# EAGLE design tps92512 (EAGLE 7.1.0)
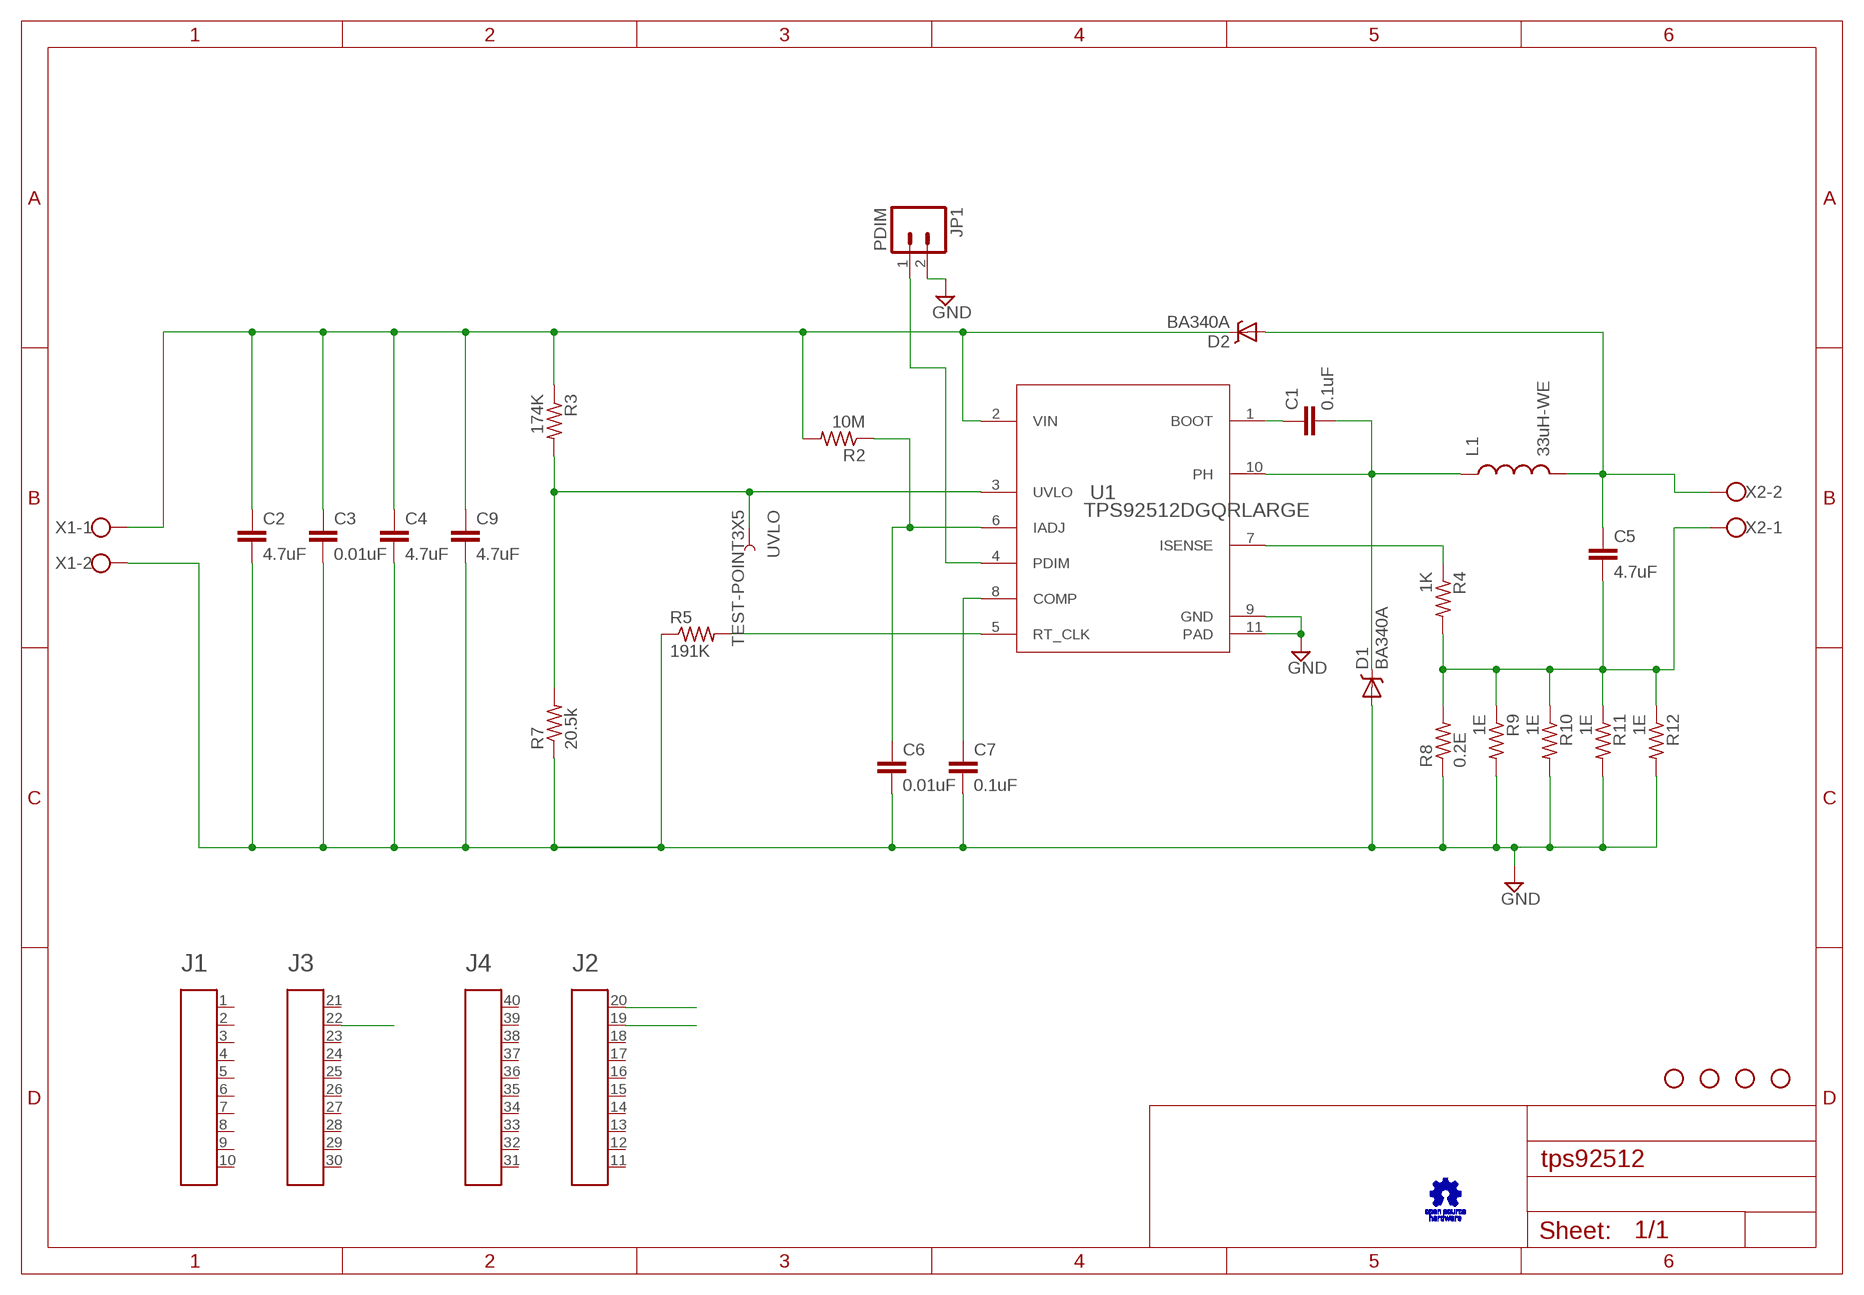
[diagram p0: schematic, sheet 1]

## Parts
A1  HEADER4X10-BOOSTERPACK  [4X10-BOOSTERPACK]
C1  0.1uF  CAP0805  [0805]
C2  4.7uF  10UF50V20%(1210)  [1210]
C3  0.01uF  CAP0805  [0805]
C4  4.7uF  10UF50V20%(1210)  [1210]
C5  4.7uF  10UF-6.3V-20%(1206)  [1206]
C6  0.01uF  CAP0805  [0805]
C7  0.1uF  CAP0805  [0805]
C9  4.7uF  10UF50V20%(1210)  [1210]
D1  BA340A  B340A  [SMA-DIODE]
D2  BA340A  B340A  [SMA-DIODE]
JP1  PDIM  M02LOCK  [1X02_LOCK]
L1  33uH-WE  INDUCTORDR1030  [DR1030]
R2  10M  R-US_R0805  [R0805]
R3  174K  R-US_R0805  [R0805]
R4  1K  R-US_R0805  [R0805]
R5  191K  R-US_R0805  [R0805]
R7  20.5k  R-US_R0805  [R0805]
R8  0.2E  R-US_R1210W  [R1210W]
R9  1E  R-US_R0805  [R0805]
R10  1E  R-US_R0805  [R0805]
R11  1E  R-US_R0805  [R0805]
R12  1E  R-US_R0805  [R0805]
STANDOFF1  STAND-OFF  [STAND-OFF]
STANDOFF2  STAND-OFF  [STAND-OFF]
STANDOFF3  STAND-OFF  [STAND-OFF]
STANDOFF4  STAND-OFF  [STAND-OFF]
U1  TPS92512DGQRLARGE  [DGQ0010D_M]
UVLO  TEST-POINT3X5  [PAD.03X.05]
X1  W237-102  [W237-102]
X2  W237-102  [W237-102]

## Nets
GND: A1.20 A1.22 C2.2 C3.2 C4.2 C6.2 C7.2 C9.2 D1.A JP1.2 R5.1 R7.1 R8.1 R9.2 R10.2 R11.2 R12.2 U1.9(GND) U1.11(PAD) X1.2
LEDMINUS: C5.2 R4.2 R8.2 R9.1 R10.1 R11.1 R12.1 X2.1
LEDPLUS: C5.1 D2.A L1.2 X2.2
N$1: C7.1 U1.8(COMP)
N$4: C6.1 R2.1 U1.6(IADJ)
N$5: C1.1 U1.1(BOOT)
N$8: R5.2 U1.5(RT_CLK)
N$9: R3.2 R7.2 U1.3(UVLO) UVLO.P$1
N$12: R4.1 U1.7(ISENSE)
PDIM: A1.19 JP1.1 U1.4(PDIM)
PINTEN: C1.2 D1.C L1.1 U1.10(PH)
VIN: C2.1 C3.1 C4.1 C9.1 D2.C R2.2 R3.1 U1.2(VIN) X1.1
Unconnected: A1.1 A1.2 A1.3 A1.4 A1.5 A1.6 A1.7 A1.8 A1.9 A1.10 A1.11 A1.12 A1.13 A1.14 A1.15 A1.16 A1.17 A1.18 A1.21 A1.23 A1.24 A1.25 A1.26 A1.27 A1.28 A1.29 A1.30 A1.31 A1.32 A1.33 A1.34 A1.35 A1.36 A1.37 A1.38 A1.39 A1.40

## Library data of the parts
A1 = EAGLE_BoosterPack_Library:HEADER4X10-BOOSTERPACK
C1 C3 C6 C7 = SparkFun-Capacitors:CAP: Capacitor Standard 0603 ceramic capacitor, and 0.1" leaded capacitor.
C2 C4 C9 = SparkFun-Capacitors:10UF50V20%(1210): CAP-09824; PROD_ID: CAP-09824; VALUE: 10uF
C5 = SparkFun-Capacitors:10UF-6.3V-20%(1206): Ceramic CAP-10057; PROD_ID: CAP-10057; VALUE: 10uF
D1 D2 = SparkFun-DiscreteSemi:B340A: Schottky Diode 3A-40V; PROD_ID: DIO-09886
JP1 = SparkFun-Connectors:M02: Standard 2-pin 0.1" header. Use with - straight break away headers ( PRT-00116) - right angle break away headers (PRT-00553) - swiss pins (PRT-00743) - machine pins (PRT-00117) - female headers (PRT-00115) Molex polarized connector foot print use with: PRT-08233 with associated crimp pins and housings. 2.54_SCREWTERM for use with PRT-10571. 3.5mm Screw Terminal footprints for PRT-08084 5mm Screw Terminal footprints for use with PRT-08433
L1 = SparkFun-Passives:INDUCTOR: Inductors Basic Inductor/Choke - 0603 and 1206. Footprints are not proven and vary greatly between part numbers. SRN6045- 33uH, 20% 1.4A SDR0403-560KL - 56uH, 10%, 500mA RMS/740mA peak
R2-R5 R7-R12 = adafruit:R-US_: RESISTOR, American symbol
STANDOFF1-STANDOFF4 = SparkFun-Electromechanical:STAND-OFF: #4 Stand Off This is the mechanical footprint for a #4 phillips button head screw. Use the keepout ring to avoid running the screw head into surrounding components. SKU : PRT-00447
U1 = TPS92512:TPS92512DGQR
UVLO = SparkFun-Passives:TEST-POINT: Bare copper test points for troubleshooting or ICT
X1 X2 = con-wago-500:W237-102: WAGO SCREW CLAMP; MPN: 237-102; OC_FARNELL: unknown; OC_NEWARK: 70K9898

## Board
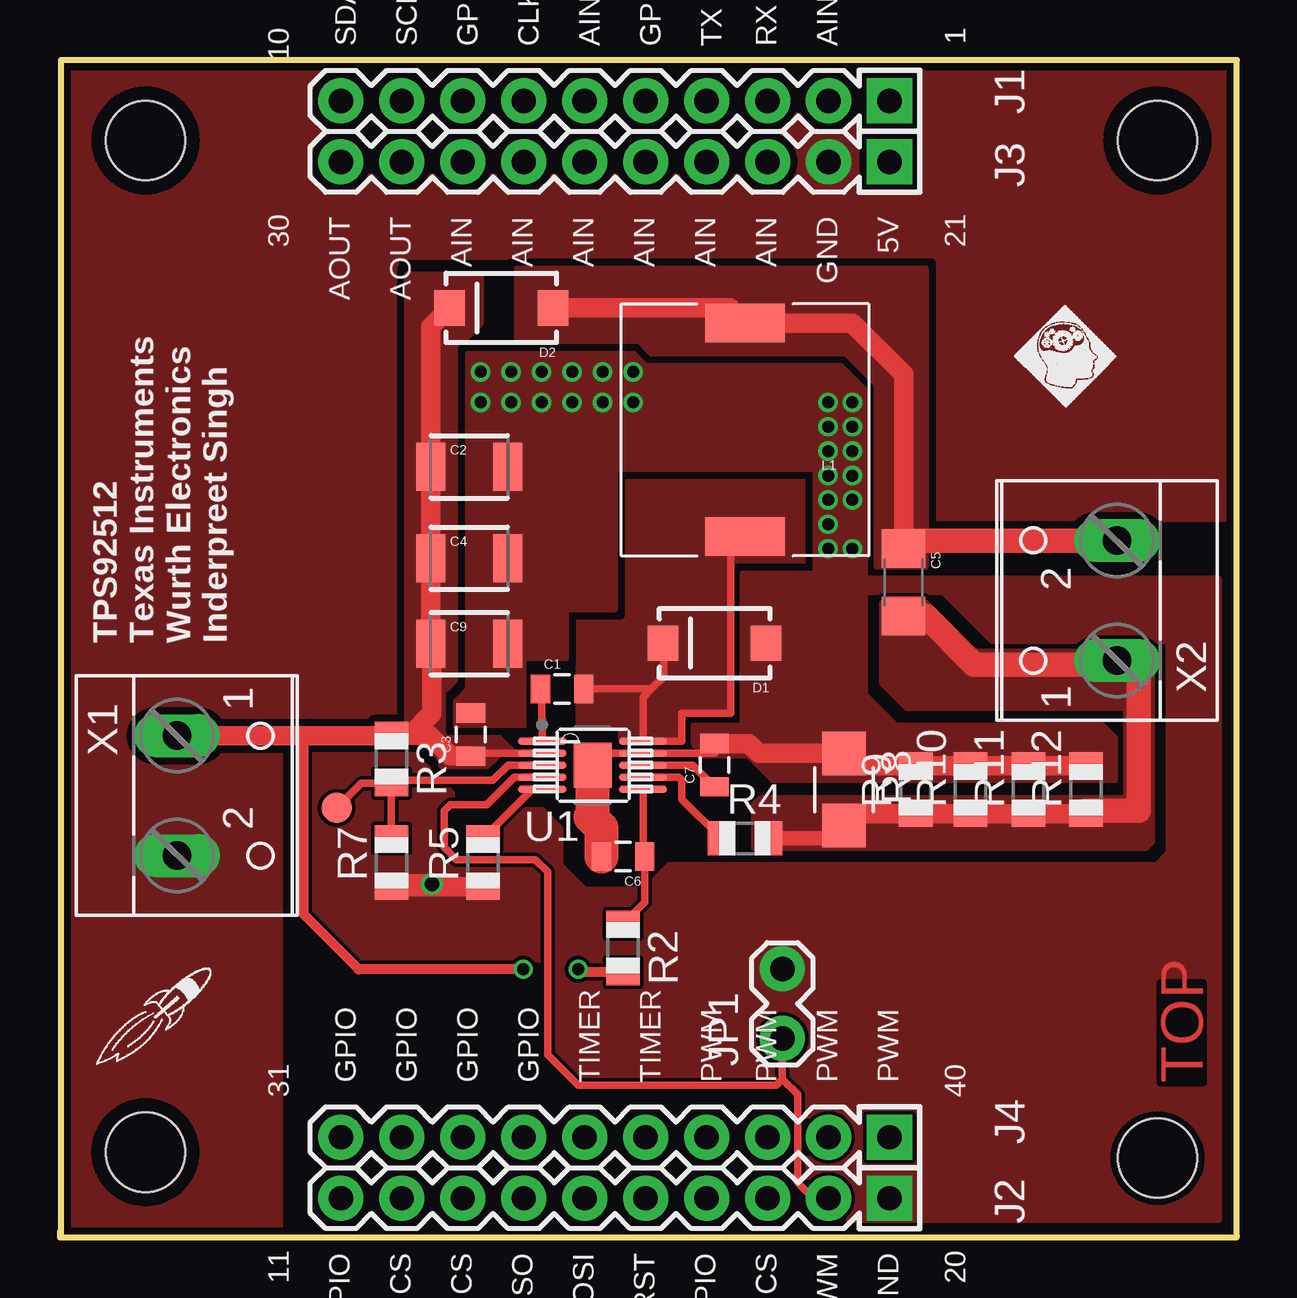
[diagram p1: board, top side]
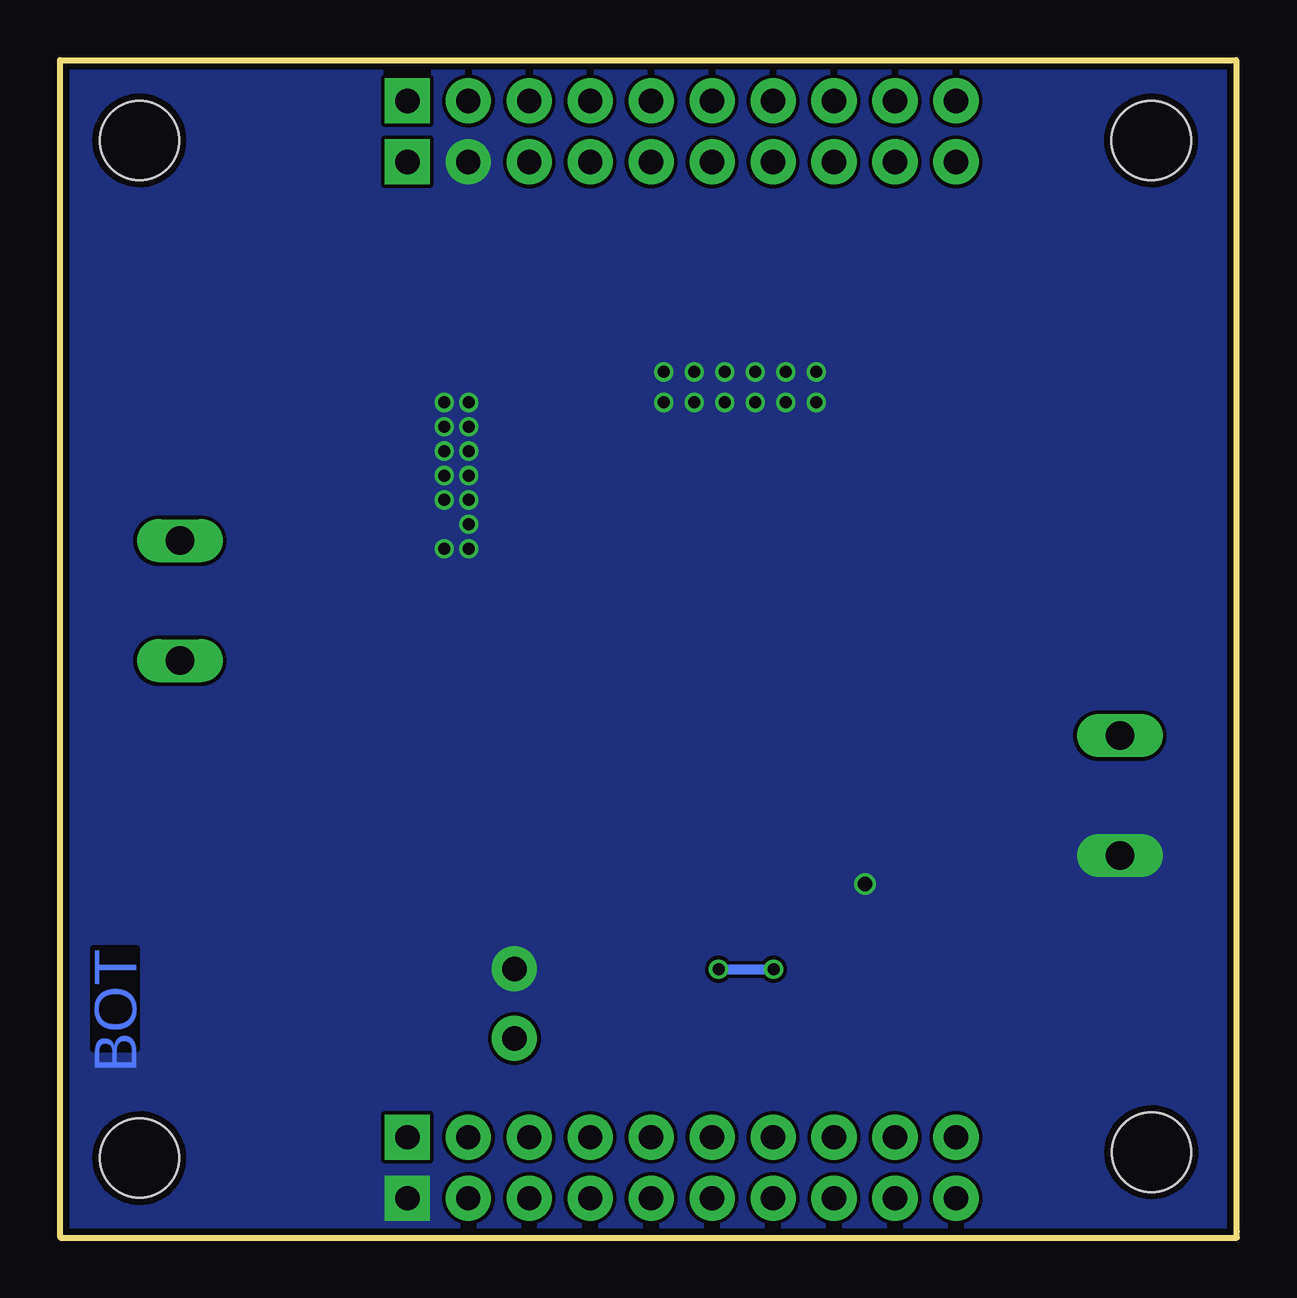
[diagram p2: board, bottom side, seen from below]

Size 49.03 x 49.06 mm. Coordinates in mm from the lower left corner, seen from the top.
Outline: 49.03,0.06 49.03,49.06 0.03,49.06 0.03,0.06
Outline: 49.02,0 0,0 0,0.25
Copper layers (1*16): Top 0.035mm / dielectric 1.5mm / Bottom 0.035mm
Design rules "SeeedStudio_2layer_DRU_no_angle_20140221": minimum track width 6mil, minimum drill 12mil, track to track 6mil, track to pad 6mil, pad to pad 6mil, via to via 6mil, smd to smd 0mil, copper to edge 10mil, drill to drill 10mil, minimum pad ring 10mil, minimum via ring 6mil, stop-mask expansion 2mil, vias tented up to drill 100mil, thermal gap 10mil

### Footprints (pad centres in the part's own frame; a part is rotated, then mirrored left to right if it is on the bottom)
4X10-BOOSTERPACK = drill 1.016 pad 1.88 square: 1 0,10.16; 20 45.72,10.16; 21 2.54,10.16; 40 43.18,10.16 | drill 1.016 pad 1.88: 2 0,7.62; 3 0,5.08; 4 0,2.54; 5 0,0; 6 0,-2.54; 7 0,-5.08; 8 0,-7.62; 9 0,-10.16; 10 0,-12.7; 11 45.72,-12.7; 12 45.72,-10.16; 13 45.72,-7.62; 14 45.72,-5.08; 15 45.72,-2.54; 16 45.72,0; 17 45.72,2.54; 18 45.72,5.08; 19 45.72,7.62; 22 2.54,7.62; 23 2.54,5.08; 24 2.54,2.54; 25 2.54,0; 26 2.54,-2.54; 27 2.54,-5.08; 28 2.54,-7.62; 29 2.54,-10.16; 30 2.54,-12.7; 31 43.18,-12.7; 32 43.18,-10.16; 33 43.18,-7.62; 34 43.18,-5.08; 35 43.18,-2.54; 36 43.18,0; 37 43.18,2.54; 38 43.18,5.08; 39 43.18,7.62
0805 = smd 0.8 x 1.2: 1 -0.9,0; 2 0.9,0
1210 = smd 1.2 x 2: 1 -1.6,0; 2 1.6,0
1206 = smd 1.6 x 1.8: 1 -1.4,0; 2 1.4,0
SMA-DIODE = smd 1.27 x 1.47: A -2.15,0; C 2.15,0
1X02_LOCK = drill 1.016 pad 1.88: 1 -0.178,0; 2 2.718,0
DR1030 = smd 3.3 x 1.6: 1 0,4.45; 2 0,-4.45
R0805 = smd 1.1 x 1.4: 1 -1,0; 2 1,0
R1210W = smd 1.8 x 1.8: 1 -1.499,0; 2 1.499,0
STAND-OFF = hole 3.302: 0,0
DGQ0010D_M = smd 2.007 x 0.305: 1 -2.1,1; 2 -2.1,0.5; 3 -2.1,0; 4 -2.1,-0.5; 5 -2.1,-1; 6 2.1,-1; 7 2.1,-0.5; 8 2.1,0; 9 2.1,0.5; 10 2.1,1 | smd 1.575 x 1.88: 11 0,0 | smd 0.508 x 0.508: V -0.45,0.6
PAD.03X.05 = smd 1.27 x 1.27: P$1 0,0
W237-102 = drill 1.194 long: 1 -2.5,-1.27; 2 2.5,-1.27

### Placement (x,y rotation side)
A1  24.4,47.36 270 top
C1  20.92,22.86 0 top
C2  17.05,32.11 0 top
C3  17.11,20.95 90 top
C4  17.05,28.3 0 top
C5  35.15,27.3 270 top
C6  23.46,15.87 180 top
C7  27.27,19.68 90 top
C9  17.05,24.75 0 top
D1  27.27,24.76 180 top
D2  18.38,38.73 180 top
JP1  30.1,8.48 90 top
L1  28.54,33.65 180 top
R2  23.46,12.06 270 top
R3  13.81,19.94 270 top
R4  28.54,16.64 0 top
R5  17.62,15.62 90 top
R7  13.81,15.62 90 top
R8  32.67,18.67 270 top
R9  35.66,18.67 90 top
R10  37.94,18.67 90 top
R11  40.36,18.66 90 top
R12  42.75,18.66 90 top
STANDOFF1  3.57,45.71 0 top
STANDOFF2  45.73,3.31 0 top
STANDOFF3  45.72,45.71 0 top
STANDOFF4  3.56,3.56 0 top
U1  22.19,19.68 0 top
U$3  [LOGO-ROCKET]  4.06,9.4 0 top
UVLO  11.53,17.91 0 top
X1  6.14,18.41 270 top
X2  42.77,26.54 90 top

### Tracks (layer width: path | path; a pad name or v marks a point on that pad's centre or on a via)
GND  (via drill 0.5, 0.6)
  Top 0.305: C7.2 27.27,20.18 U1.9 22.19,20.18 U1.11
  Top 0.813: R12.2 R11.2 R10.2 R9.2 33.17,19.67 R8.1 29.11,20.17 28.7,20.57 C7.2 | R5.1 R7.1 13.92,14.73 v15.49,14.73
  Top 1.422: C6.2 22.56,17.06 22.1,17.53 22.19,17.53 U1.11
  other vias: 17.53,36.07 18.8,36.07 20.07,36.07 21.34,36.07 22.61,36.07 23.88,36.07 17.53,34.8 18.8,34.8 20.07,34.8 21.34,34.8 22.61,34.8 23.88,34.8 32,34.8 33.02,34.8 33.02,33.78 33.02,32.77 32,32.77 32,33.78 32,31.75 33.02,30.73 32,30.73 33.02,31.75 32,29.72 32,28.7 33.02,28.7
  pour Top (no thermals): 26.42,20.57 26.42,21.34 28.45,21.34 28.45,27.69 31.5,27.69 31.5,32 23.11,32 23.11,26.16 21.08,26.16 21.08,24.13 19.3,24.13 19.3,21.34 16.51,21.34 16.51,22.35 17.02,22.86 17.02,36.83 23.88,36.83 24.38,36.32 32.51,36.32 33.53,35.31 33.53,22.61 34.8,21.34 43.43,21.34 43.94,20.83 43.94,19.05 29.72,19.05 28.7,20.07 26.67,20.07 26.67,20.32
  pour Bottom (no thermals): 0.51,48.77 48.51,48.77 48.51,48.01 48.77,48.01 48.77,0.51 0.51,0.51
  pour Top (isolate 0.305, rank 5, no thermals): 13.97,21.84 13.97,40.89 36.58,40.89 36.58,29.97 48.77,29.97 48.77,48.77 0.25,48.77 0.25,0.25 9.14,0.25 9.14,21.59 13.72,21.59 13.72,21.84
  pour Top (no thermals): 9.14,0.51 9.14,20.07 14.73,20.07 16.51,18.29 18.03,18.29 18.29,18.54 18.54,18.54 19.3,17.78 20.07,17.78 20.83,17.02 20.83,15.49 21.84,14.48 24.38,14.48 25.4,15.49 45.72,15.49 46.23,16 46.23,24.89 38.86,24.89 36.83,26.92 32.51,26.92 32.51,27.43 48.26,27.43 48.26,0.76 9.4,0.76
LEDMINUS
  Top 0.61: R4.2 32.67,16.64 R8.2
  Top 0.813: R12.1 R11.1 R10.1 R9.1 33.17,17.67 R8.2
  Top 1.016: C5.2 36.07,25.9 38.1,23.88 43.87,23.88 | 43.87,23.88 X2.1 | 43.87,23.88 44.96,23.88 44.96,17.78 42.75,17.78 R12.1
  pour Top (no thermals): 34.29,26.42 34.29,23.11 35.31,22.1 44.45,22.1 44.45,18.29 29.21,18.29 28.96,18.03 28.96,16.26 45.21,16.26 45.47,16.51 45.47,24.38 38.1,24.38 36.07,26.42
LEDPLUS
  Top 0.813: D2.A 27.91,38.73 L1.2 33.02,38.1 35.15,35.97 C5.1
  Top 1.016: X2.2 35.15,29.04 C5.1
  pour Top (no thermals): 19.05,40.39 36.07,40.39 36.07,27.94 34.04,27.94 34.04,35.56 32.77,36.83 24.64,36.83 24.13,37.34 19.3,37.34 19.05,37.34
N$1
  Top 0.305: U1.8 26.37,19.68 C7.1
N$4
  Top 0.305: U1.6 24.29,15.94 C6.1 24.36,13.96 R2.1
N$5
  Top 0.305: C1.1 20.07,22.86 20.07,21.59 20.09,21.59 U1.1
N$8
  Top 0.305: U1.5 19.69,18.68 R5.2
N$9
  Top 0.305: U1.3 18.67,19.68 18.03,19.05 13.92,19.05 R3.2 | R3.2 12.56,18.94 UVLO.P$1 | R7.2 R3.2
N$12
  Top 0.305: U1.7 25.77,19.18 25.91,19.05 25.91,18.27 R4.1
PDIM
  Top 0.305: U1.4 18.93,19.18 17.78,18.03 16.26,18.03 16,17.78 16,16.26 16.51,15.75 19.81,15.75 20.32,15.24 20.32,7.62 21.59,6.35 29.85,6.35 30.1,6.6 | JP1.1 30.1,6.6 | A1.19 31.38,1.64 30.73,2.29 30.73,5.97 30.1,6.6
PINTEN
  Top 0.305: C1.2 24.64,22.86 | 24.64,22.86 25.15,23.37 25.15,24.74 D1.C | 24.64,22.86 24.29,22.52 U1.10 25.91,20.68 25.91,21.84 27.94,21.84 27.94,29.2 L1.1
  pour Top (isolate 0.305, rank 2, no thermals): 25.91,20.83 25.91,21.84 27.94,21.84 27.94,28.19 30.99,28.19 30.99,31.5 23.62,31.5 23.62,25.65 21.59,25.65 21.59,21.34 23.37,21.34 23.37,20.83
VIN  (via drill 0.5)
  Top 0.305: U1.2 17.11,20.18 C3.1
  Top 0.406: R2.2 21.7,11.06 v21.59,11.18 | v19.3,11.18 12.45,11.18 10.16,13.46 10.16,20.66 10.41,20.91
  Top 0.813: X1.1 10.41,20.91 13.79,20.91 R3.1 | R3.1 14.59,20.94 15.49,21.84 15.49,24.7 C9.1 C4.1 C2.1 15.45,37.95 D2.C | R3.1 15.38,20.94 16.26,20.07 17.1,20.07 C3.1
  Bottom 0.406: v21.59,11.18 v19.3,11.18
  pour Top (isolate 0.305, rank 3, no thermals): 19.05,20.07 18.29,20.07 17.78,19.56 16,19.56 14.99,20.57 14.48,20.57 14.48,40.13 17.53,40.13 17.53,38.1 16.51,37.08 16.51,23.11 16,22.61 16,20.83 18.29,20.83

### Text on the board
Top: TOP
Bottom: BOT
tPlace: TPS92512 / Texas Instruments / Wurth Electronics / Inderpreet Singh